# Altium project _nRF9160_tracker.PrjPcb
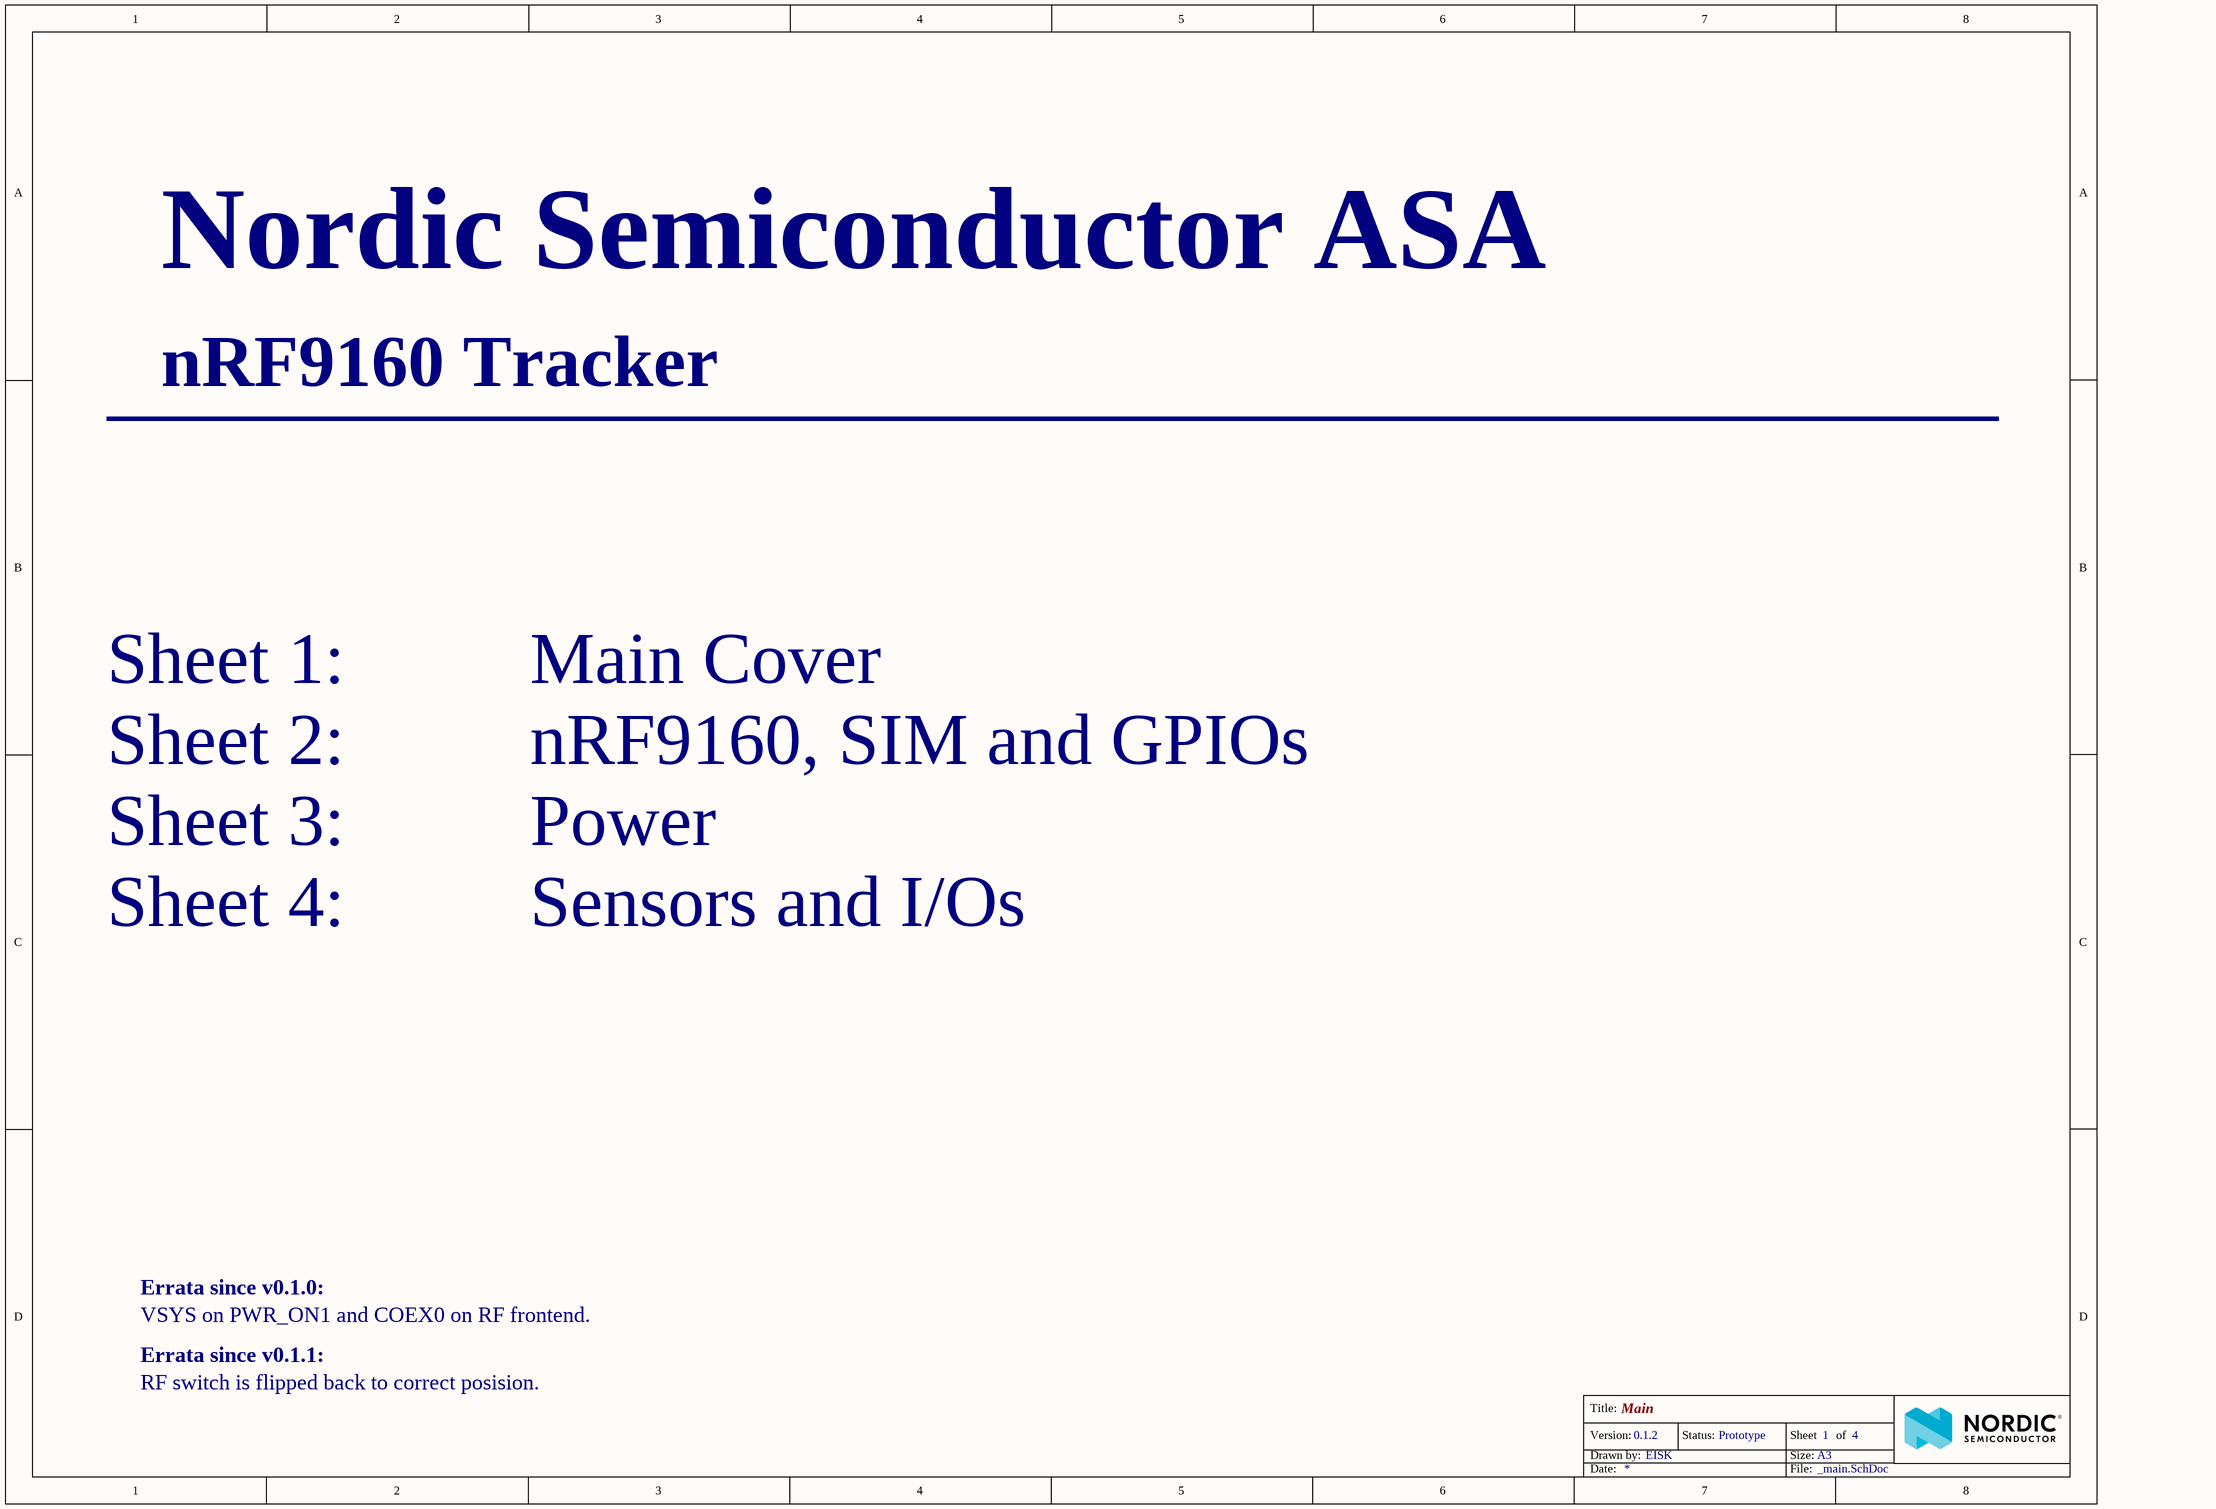
[diagram p0: _main.SchDoc]
4 sheets, 83 parts. Net scope: flat (ports and power ports of the same name join across sheets).
Board file: _tracker.PcbDoc
Sheets:
  _main.SchDoc
  _power.SchDoc
  _nRF9160.SchDoc
  _sensors_and_IOs.SchDoc

## Sheet _main.SchDoc: Main
size A3; CompanyName: Nordic Semiconductor; DrawnBy: EISK; Organization: Nordic Semiconductor; Revision: 1; SheetNumber: 1; SheetTotal: 4; Version: 0.1.2; DesignStatus: Prototype; BoardTitle: nRF9160 Tracker; Time: 2

### Notes on the sheet
- Nordic Semiconductor ASA
- ___________________________________________
- Sheet 1:          Main Cover
- Sheet 2:          nRF9160, SIM and GPIOs
- Sheet 3:          Power
- Sheet 4:          Sensors and I/Os
- Errata since v0.1.0:
- Errata since v0.1.1:
- VSYS on PWR_ON1 and COEX0 on RF frontend.
- RF switch is flipped back to correct posision.
- Title:
- Version:
- Drawn by:
- Status:
- Size:
- Sheet
- A3
- of
- Date:
- File:

## Sheet _power.SchDoc: Power
size A3; DrawnBy: EISK; SheetNumber: 3; SheetTotal: 4; Version: 0.1.2; DesignStatus: Prototype
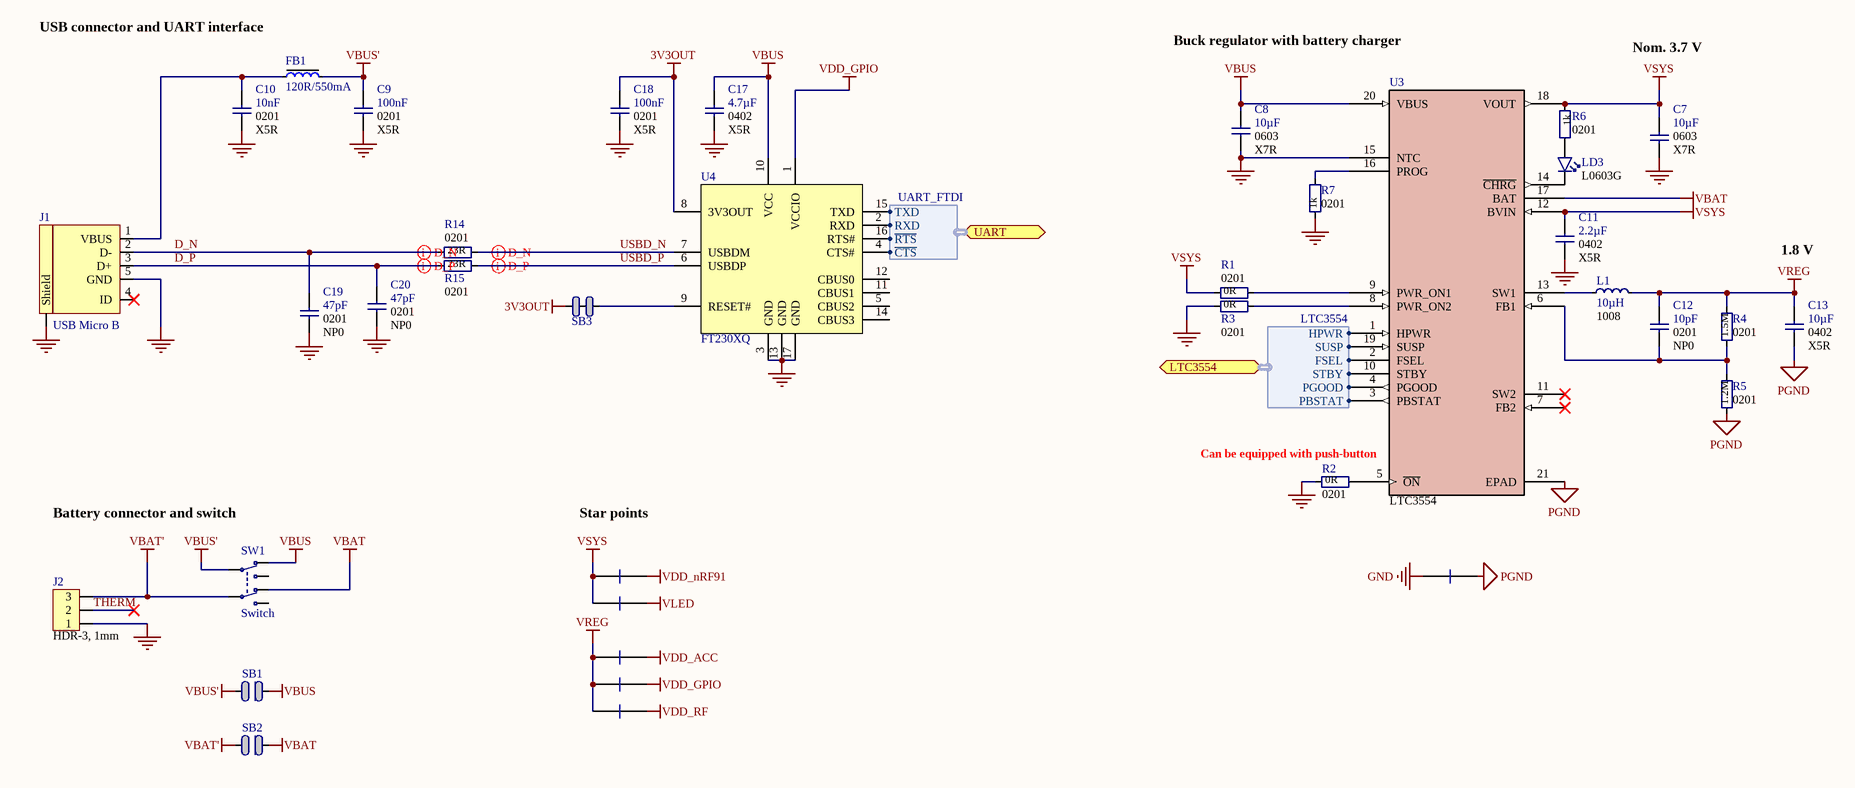
[diagram p1: _power.SchDoc]

### Parts
C7  10µF  Footprint Doc: 0603  TempCoeff: X7R  [CAPC1608X06L]
C8  10µF  Footprint Doc: 0603  TempCoeff: X7R  [CAPC1608X06L]
C9  100nF  Footprint Doc: 0201  TempCoeff: X5R  [CAPC0603X03L_C]
C10  10nF  Footprint Doc: 0201  TempCoeff: X5R  [CAPC0603X03L_C]
C11  2.2µF  Footprint Doc: 0402  TempCoeff: X5R  [CAPC1005X04L]
C12  10pF  Footprint Doc: 0201  TempCoeff: NP0  [CAPC0603X03L_C]
C13  10µF  Footprint Doc: 0402  TempCoeff: X5R  [CAPC1005X04L]
C17  4.7µF  Footprint Doc: 0402  TempCoeff: X5R  [CAPC1005X04L]
C18  100nF  Footprint Doc: 0201  TempCoeff: X5R  [CAPC0603X03L_C]
C19  47pF  Footprint Doc: 0201  TempCoeff: NP0  [CAPC0603X03L_C]
C20  47pF  Footprint Doc: 0201  TempCoeff: NP0  [CAPC0603X03L_C]
FB1  120R/550mA  [INDC1005X04L]
J1  USB Micro B  [USB-Micro-B-RA-SMD-PiP]
J2  HDR-3, 1mm  [SM03B-SRSS-TB]
L1  10µH  Footprint Doc: 1008  [IND1008]
LD3  L0603G  [LED_0603_G]
NT1  Star point  [Net_tie_GND]  (value not drawn)  (net tie, no BOM)
NT2  Star point  [Net_tie_trace]  (value not drawn)  (net tie, no BOM)
NT3  Star point  [Net_tie_trace]  (value not drawn)  (net tie, no BOM)
NT4  Star point  [Net_tie_trace]  (value not drawn)  (net tie, no BOM)
NT5  Star point  [Net_tie_trace]  (value not drawn)  (net tie, no BOM)
NT6  Star point  [Net_tie_trace]  (value not drawn)  (net tie, no BOM)
R1  0R  Footprint Doc: 0201  [RESC0603X03L_C]
R2  0R  Footprint Doc: 0201  [RESC0603X03L_C]
R3  0R  Footprint Doc: 0201  [RESC0603X03L_C]
R4  1.5M  Footprint Doc: 0201  [RESC0603X03L_C]
R5  1.2M  Footprint Doc: 0201  [RESC0603X03L_C]
R6  1k  Footprint Doc: 0201  [RESC0603X03L_C]
R7  1k  Footprint Doc: 0201  [RESC0603X03L_C]
R14  23R  Footprint Doc: 0201  [RESC0603X03L_C]
R15  23R  Footprint Doc: 0201  [RESC0603X03L_C]
SB1  Solderbridge  [Solderbridge]  (value not drawn)  (no BOM)
SB2  Solderbridge  [Solderbridge]  (value not drawn)  (no BOM)
SB3  Solderbridge  [Solderbridge_Shorted]  (value not drawn)  (net tie, no BOM)
SW1  Switch  [Switch-Slide-RA-J-Lead-DPDT-8.5x3.5mm]
U3  LTC3554  [QFN40P300X300X80_HS-21N]
U4  FT230XQ  [QFN65P400X400X80_HS-17N]

### Blocks framed on the sheet
Battery connector and switch: J2 SB1 SB2 SW1

### Ports
LTC3554 (bidir, harness LTC3554), UART (bidir, harness UART_FTDI)

### Harnesses
UART_FTDI: TXD, RXD, ~{RTS}, ~{CTS}
LTC3554: HPWR, SUSP, FSEL, STBY, PGOOD, PBSTAT

### Nets
3V3OUT: C18.1 SB3.2 U4.8(3V3OUT)
GND: C7.2 C8.2 C9.2 C10.2 C11.2 C17.2 C18.2 C19.1 C20.2 J1.5(GND) J1.6(Shield) J2.1 NT1.1 R2.1 R3.1 R7.1 U3.15(NTC) U4.3(GND) U4.13(GND) U4.17(GND)
PGND: C13.2 NT1.2 R5.1 U3.21(EPAD)
VBAT: SB2.2 SW1.6(N.C-2) U3.17(BAT)
VBAT': J2.3 SB2.1 SW1.5(COM-2)
VBUS: C8.1 C17.1 SB1.2 SW1.3(N.C-1) U3.20(VBUS) U4.10(VCC)
VBUS': C9.1 FB1.2 SB1.1 SW1.2(COM-1)
VDD_ACC: NT4.2
VDD_GPIO: NT5.2 U4.1(VCCIO)
VDD_nRF91: NT2.2
VDD_RF: NT6.2
VLED: NT3.2
VREG: C12.1 C13.1 L1.2 NT4.1 NT5.1 NT6.1 R4.2
VSYS: C7.1 C11.1 NT2.1 NT3.1 R1.1 R6.1 U3.12(BVIN) U3.18(VOUT)
D_N: C19.2 J1.2(D-) R14.1
D_P: C20.1 J1.3(D+) R15.1
P0.01: U4.15(TXD) ; port UART.TXD
P0.02: U4.2(RXD) ; port UART.RXD
P0.03: U4.16(RTS#) ; port UART.~{RTS}
P0.04: U4.4(CTS#) ; port UART.~{CTS}
P0.26: U3.10(STBY) ; port LTC3554.STBY
P0.27: U3.19(SUSP) ; port LTC3554.SUSP
P0.28: U3.1(HPWR) ; port LTC3554.HPWR
P0.29: U3.2(FSEL) ; port LTC3554.FSEL
P0.30: U3.3(PBSTAT) ; port LTC3554.PBSTAT
P0.31: U3.4(PGOOD) ; port LTC3554.PGOOD
THERM: J2.2
USBD_N: R14.2 U4.7(USBDM)
USBD_P: R15.2 U4.6(USBDP)
NetC10_1: C10.1 FB1.1 J1.1(VBUS)
NetC12_2: C12.2 R4.1 R5.2 U3.6(FB1)
NetL1_1: L1.1 U3.13(SW1)
NetLD3_1: LD3.1(C) U3.14(~{CHRG})
NetLD3_2: LD3.2(A) R6.2
NetR1_2: R1.2 U3.9(PWR_ON1)
NetR2_2: R2.2 U3.5(~{ON})
NetR3_2: R3.2 U3.8(PWR_ON2)
NetR7_2: R7.2 U3.16(PROG)
NetSB3_1: SB3.1 U4.9(RESET#)

Not connected (* = marked no-connect by the designer): J1 4(ID)*; SW1 1(N.O-1) 4(N.O-2); U3 7(FB2)* 11(SW2)*; U4 5(CBUS2) 11(CBUS1) 12(CBUS0) 14(CBUS3)

### Layout directives
differential pair; differential pair class D1: D_N, D_P, USBD_N, USBD_P

### Notes on the sheet
- (near FB1) USB connector and UART interface
- Buck regulator with battery charger
- Nom. 3.7 V
- (near U3) 500 mA charge current from USB host.
- 1.8 V
- Star points
- (near U3) Can be equipped with push-button
- Title:
- Version:
- Drawn by:
- Status:
- Size:
- Sheet
- A3
- of
- Date:
- File:

### Library data of the parts
C7 C8 = CAP:0603: Capacitor, X7R, ±10%; Note: s; Artikkelnr Noca: N.A.; Manufacturer: *; Manufacturer Part Number: *; LatestRevisionDate: 2014-11-13; Pin Count: 2; Publisher: Nordic Semiconductor; Published: 2014-11-13; Value: 10µF; HelpURL: *; Supplier 1: *; Supplier Part Number 1: *; Supplier 2: *; Supplier Part Number 2: *
C9 C10 C18 = CAP:0201: Capacitor, X5R, ±10%, 10V; Artikkelnr Noca: N.A.; Manufacturer: *; Manufacturer Part Number: *; LatestRevisionDate: 2014-11-13; Pin Count: 2; Publisher: Nordic Semiconductor; Published: 2014-11-13; HelpURL: *; Supplier 1: *; Supplier Part Number 1: *; Supplier 2: *; Supplier Part Number 2: *
  C9: Value: 100nF; Note: 10V
  C10: Value: 10nF; Note: 10V
  C18: Value: 100nF; Note: *
C11 C17 = CAP:0402: Capacitor, X5R, ±10%, 16V; Artikkelnr Noca: N.A.; Manufacturer: *; Manufacturer Part Number: *; LatestRevisionDate: 2014-11-13; Pin Count: 2; Publisher: Nordic Semiconductor; Published: 2014-11-13; Note: 16V; HelpURL: *; Supplier 1: *; Supplier Part Number 1: *; Supplier 2: *; Supplier Part Number 2: *
  C11: Value: 2.2µF
  C17: Value: 4.7µF
C12 = CAP:0201: Capacitor, NP0; Artikkelnr Noca: N.A.; Manufacturer: *; Manufacturer Part Number: *; LatestRevisionDate: 2014-11-13; Pin Count: 2; Publisher: Nordic Semiconductor; Published: 2014-11-13; Value: 10pF; Note: *; HelpURL: *; Supplier 1: *; Supplier Part Number 1: *; Supplier 2: *; Supplier Part Number 2: *
C13 = CAP:0402: Capacitor, X5R, ±20%; Note: 16V; Artikkelnr Noca: N.A.; Manufacturer: *; Manufacturer Part Number: *; LatestRevisionDate: 2014-11-13; Pin Count: 2; Publisher: Nordic Semiconductor; Published: 2014-11-13; Value: 10µF; HelpURL: *; Supplier 1: *; Supplier Part Number 1: *; Supplier 2: *; Supplier Part Number 2: *
C19 C20 = CAP:0201: Capacitor, NP0; Note: 10V; Artikkelnr Noca: N.A.; Manufacturer: *; Manufacturer Part Number: *; LatestRevisionDate: 2014-11-13; Pin Count: 2; Publisher: Nordic Semiconductor; Published: 2014-11-13; Value: 47pF; HelpURL: *; Supplier 1: *; Supplier Part Number 1: *; Supplier 2: *; Supplier Part Number 2: *
FB1 = FB0402-120R@100M-500mA: Ferrite Bead, 120 Ohm @ 100MHz, 500mA, 250 mOhm Max; Part Number: FB0805-120R@100M-550mA; Manufacturer: Murata; Manufacturer Part Number: BLM15AG121SN1D; Part number IPS: N.A.; Note: Chip EMIFIL Inductor Type Chip Ferrite Bead; Artikkelnr Noca: 33029317; Footprint Doc: 0402; LatestRevisionDate: 2019-06-06; Pin Count: 2; Publisher: Nordic Semiconductor; Published: 2011-11-14; Value: 120R/550mA; ComponentLink1Description: Datasheet; ComponentLink2URL: https://www.murata.com/en-global/products/productdata/8796733767710/S0580E.pdf; ComponentLink2Description: Datasheet; Datasheet: http://search.murata.co.jp/Ceramy/image/img/PDF/ENG/L0110S0100BLM15A_SN.pdf; Artikkelnr Simpro: N.A.; Supplier 1: Digi-Key; Supplier Part Number 1: 490-1005-1-ND
J1 = MiniUSB-AB-SMT: MicroUSB-B-SMT; Manufacturer: Amphenol ICC (FCI); Manufacturer Part Number: 10118194-0001LF; Part number IPS: 00000007790; Artikkelnr Noca: 55029020; Artikkelnr Simpro: N.A.; Part Number: USB-Micro-B-RA-SMD-PiP; Footprint Doc: USB-Micro-B-RA-SMD-PiP; LatestRevisionDate: 2016-04-21; Pin Count: 5; Publisher: Nordic Semiconductor; Published: 2014-10-07; Value: USB Micro B; Note: *; Supplier 1: Mouser; Supplier 2: Digi-Key; Supplier Part Number 1: 649-10118193-0001LF; Supplier Part Number 2: 609-4616-1-ND
J2 = CONN-3: 1.0mm pitch connector side entry SMD; Manufacturer: JST; Manufacturer Part Number: SM03B-SRSS-TB(LF)(SN); Part number IPS: 00000001785; Note: JST, Header; Artikkelnr Noca: N.A.; Part Number: SM03B-SRSS-TB; Footprint Doc: SM03B-SRSS-TB; LatestRevisionDate: 2017-10-09; Pin Count: 3; Publisher: Nordic Semiconductor; Published: 2017-10-09; Value: HDR-3, 1mm; HelpURL: http://www.jst-mfg.com/product/pdf/eng/eSH.pdf; Supplier 1: Digi-Key; Supplier Part Number 1: 455-1803-1-ND
L1 = IND:1008_REG: Switching regulator chip inductor, 2-Leads, Body 2.5x2.0x1.1 mm; Manufacturer: Wurth Electronics Inc.; Manufacturer Part Number: 74479787247; Datasheet: Not available; LatestRevisionDate: 2019-06-13; Pin Count: 2; Publisher: Nordic Semiconductor; Published: 2019-07-02; Value: 10µH; ComponentLink2Description: Supplier link; Supplier 1: Digi-Key; Supplier 2: Mouser; Supplier Part Number 1: 732-14079-1-ND; Supplier Part Number 2: 710-74479787247; ComponentLink1Description: Digi-Key
LD3 = D:LED: LED, Green, 0603, 570nm, Vf=1.7V, 2.24..5.6mcd, - 40 to +100°C; Part Number: LG L29K Smartled Green; Manufacturer: Osram; Manufacturer Part Number: LG L29K-G2J1-24-Z; Part number IPS: N.A.; Note: 2.24..5.6 mcd, Vfmin=1.7V; Artikkelnr Noca: 13019147; Footprint Doc: 0603; LatestRevisionDate: 2017-08-21; Pin Count: 2; Publisher: Nordic Semiconductor; Published: 2014-10-28; Value: L0603G; ComponentLink1URL: *; ComponentLink1Description: Datasheet; ComponentLink2URL: *; ComponentLink2Description: Supplier link; HelpURL: http://www.osram-os.com/Graphics/XPic2/00077107_0.pdf; Supplier 1: Digi-Key; Supplier Part Number 1: 475-2709-1-ND; Supplier 2: Mouser; Supplier Part Number 2: 720-LGL29KG2J124Z
NT1-NT6 = NT:Trace
R1-R7 R14 R15 = RES:0201: Manufacturer: *; Manufacturer Part Number: *; Package: 0201; Publisher: Nordic Semiconductor; LatestRevisionDate: 2019-06-11
  R1-R3: Value: 0R
  R4: Value: 1.5M
  R5: Value: 1.2M
  R6 R7: Value: 1k
  R14 R15: Value: 23R
SB1 SB2 = SOLDERBRIDGE: Note: Not in BOM; ComponentLink1URL: *; ComponentLink1Description: Datasheet; ComponentLink2URL: *; ComponentLink2Description: Supplier link; Footprint Doc: Solderbridge; Pin Count: 2; Publisher: Nordic Semiconductor; Published: 2019-07-17; Value: Solderbridge
SB3 = SOLDERBRIDGE_SHORTED: Shorted Solderbridge; Note: Not in BOM; Footprint Doc: Solderbridge Shorted; Pin Count: 2; Publisher: Nordic Semiconductor; Published: 2012-08-07; Value: Solderbridge
SW1 = SW-DPDT: SMD slide Switch (ON-ON); Part Number: Switch-Slide-RA-J-Lead-DPDT-8.5x3.5mm_Copal; Manufacturer: Copal Electronics Inc; Manufacturer Part Number: CL-SB-22A-11T; Part number IPS: 00000007811; Artikkelnr Noca: N.A.; Footprint Doc: Switch-Slide-RA-J-Lead-DPDT-8.5x3.5mm; LatestRevisionDate: 2017-02-01; Pin Count: 6; Publisher: Nordic Semiconductor; Published: 2017-02-01; Value: Switch; Note: *; HelpURL: http://www.nidec-copal-electronics.com/e/catalog/switch/cl-sb.pdf; Supplier 1: Digi-Key; Supplier Part Number 1: 563-1340-1-ND; Supplier 2: Avnet; Supplier Part Number 2: CL-SB-22A-11T
U3 = LTC3554EUD-3#PBF: IC USB POWER MANAGER 20UTQFN; Vendor: Linear Technology; Built_By: Eirik Hovde Skanke; Manufacturer_Part_Number: LTC3554EUD-3#PBF; Copyright: Nordic Semiconductor; Value: LTC3554; ComponentLink1Description: Datasheet; ComponentLink1URL: https://www.analog.com/media/en/technical-documentation/data-sheets/355412ff.pdf; ComponentLink2Description: Digi-Key; ComponentLink2URL: https://www.digikey.com/product-detail/en/linear-technology-analog-devices/LTC3554EUD-PBF/LTC3554EUD-PBF-ND/2355199
U4 = FT230X: USB Bridge, USB to UART USB 2.0 UART Interface 16-QFN (4x4); Manufacturer: FTDI; Artikkelnr Noca: N.A.; Part Number: FT230XQ; Manufacturer Part Number: FT230XQ; Footprint Doc: QFN-16; LatestRevisionDate: 2019-07-04; Pin Count: 16; Publisher: Nordic Semiconductor; Published: 2019-07-04; Value: FT230XQ; Note: *; Supplier 1: Digi-Key; Supplier Part Number 1: 768-1130-1-ND; ComponentLink1Description: Datasheet; ComponentLink1URL: https://www.ftdichip.com/Support/Documents/DataSheets/ICs/DS_FT230X.pdf

## Sheet _nRF9160.SchDoc: nRF9160, SIM and GPIOs
size A3; CompanyName: Nordic Semiconductor ASA; DrawnBy: EISK; SheetNumber: 2; SheetTotal: 4; DesignStatus: Prototype; Version: 0.1.2
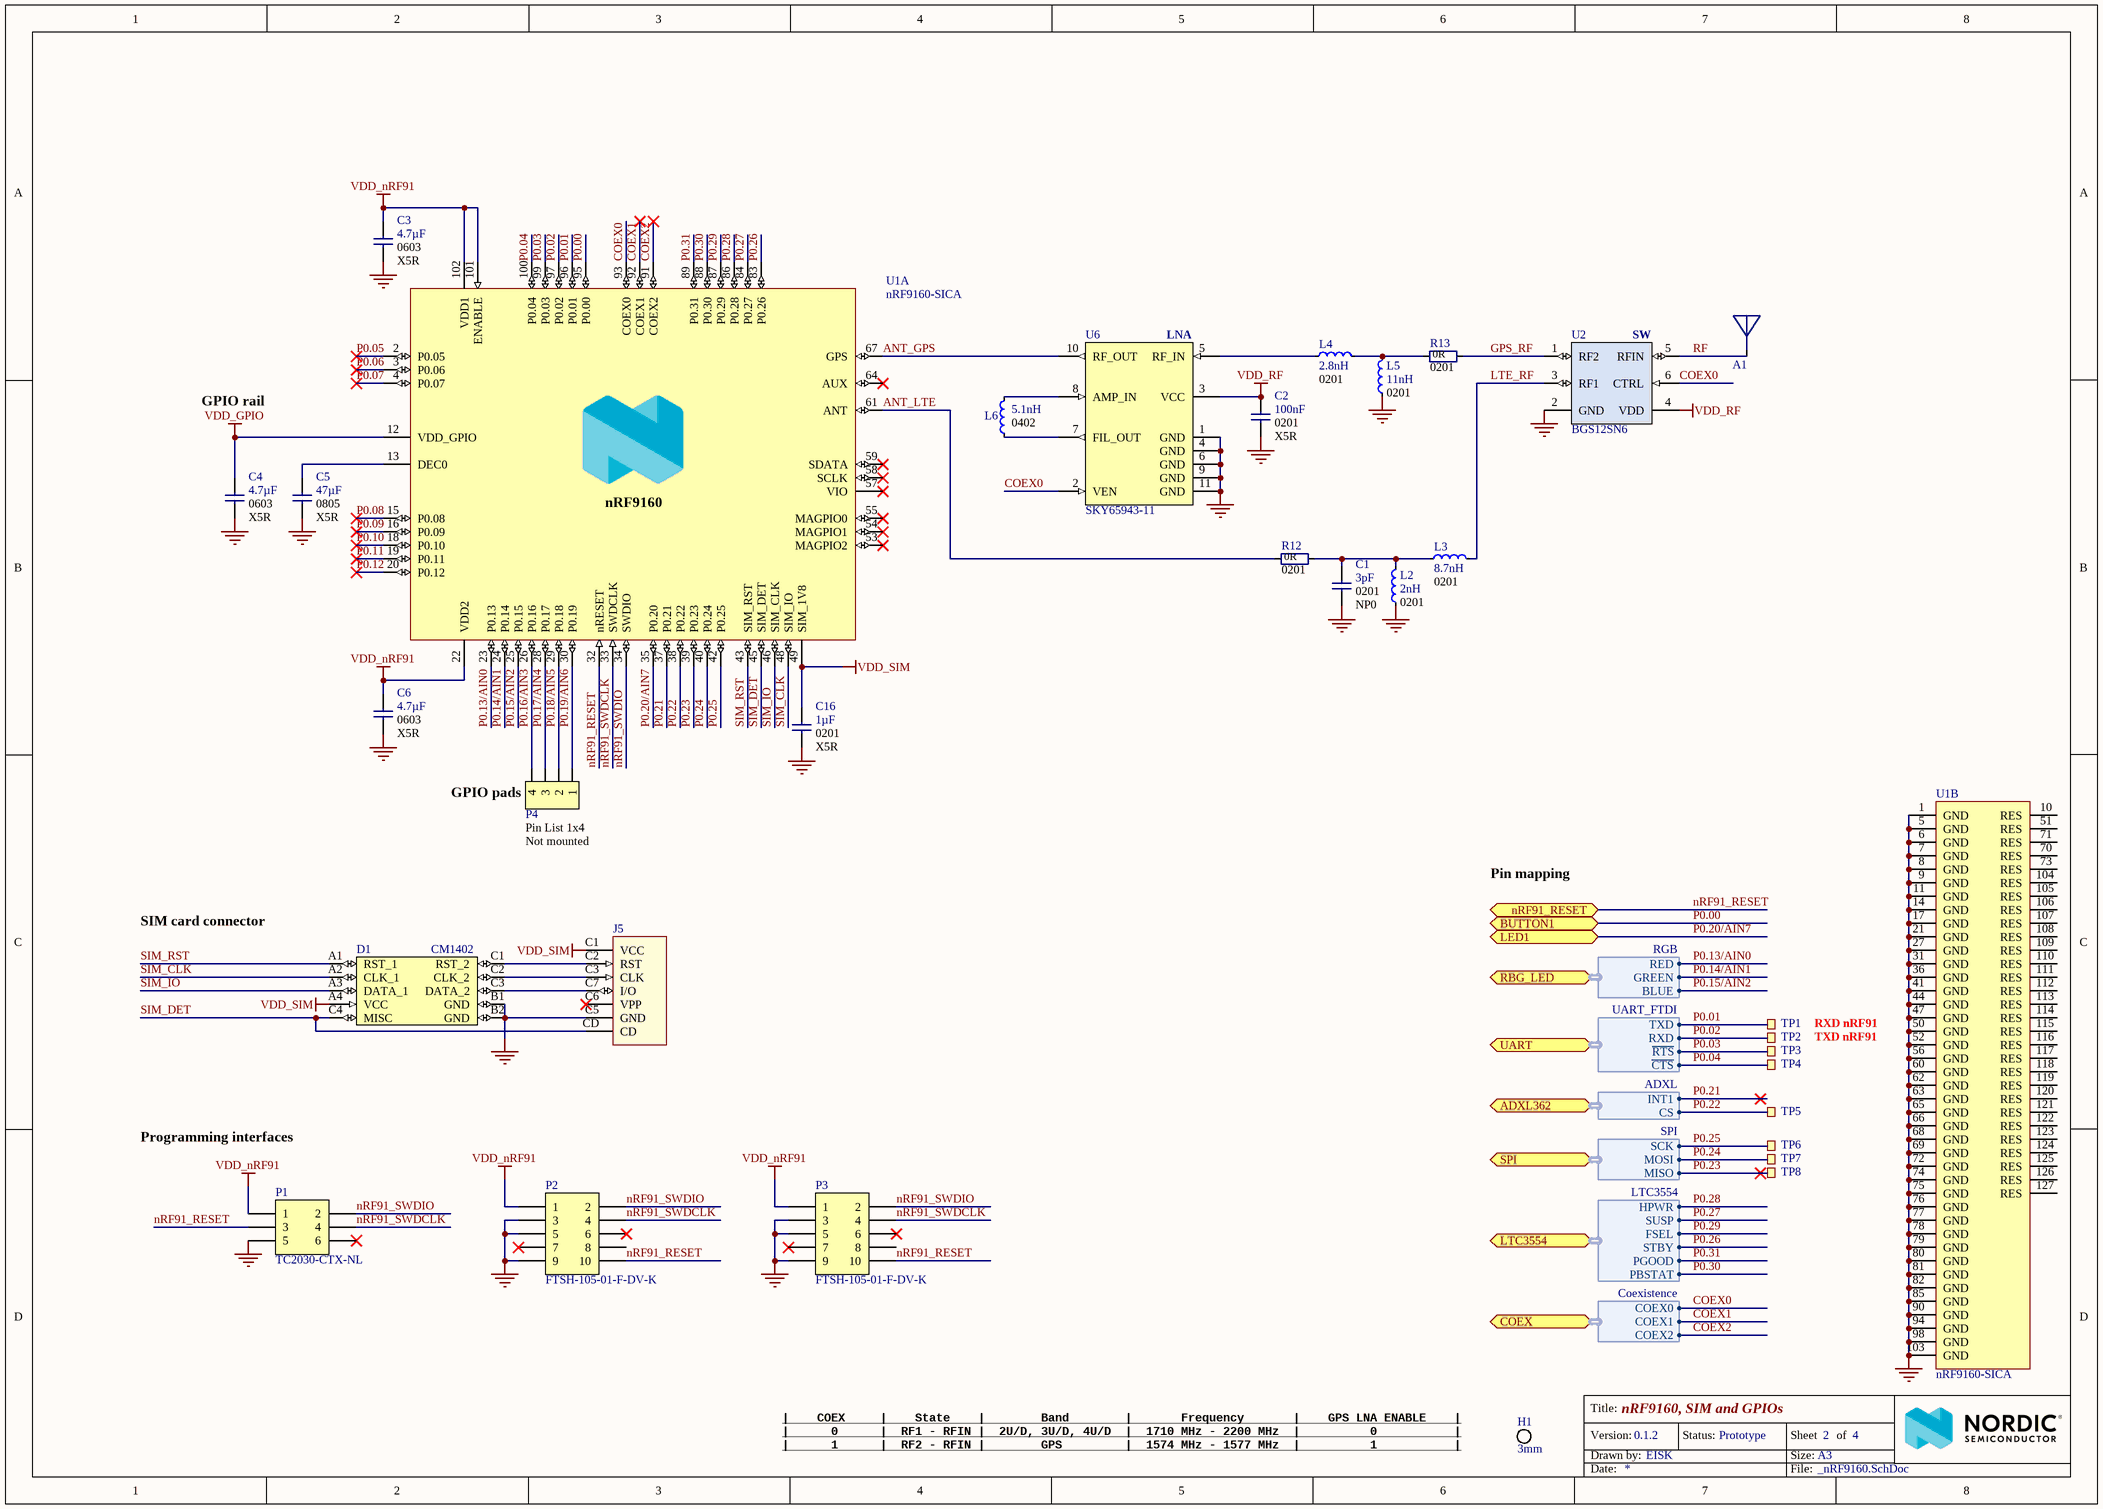
[diagram p2: _nRF9160.SchDoc]

### Parts
A1  FR01-S4-250  [FRACTUS_CUBE_mXTEND]  (value not drawn)
C1  3pF  Footprint Doc: 0201  TempCoeff: NP0  [CAPC0603X03L_C]
C2  100nF  Footprint Doc: 0201  TempCoeff: X5R  [CAPC0603X03L_C]
C3  4.7µF  Footprint Doc: 0603  TempCoeff: X5R  [CAPC1608X06L]
C4  4.7µF  Footprint Doc: 0603  TempCoeff: X5R  [CAPC1608X06L]
C5  47µF  Footprint Doc: 0805  TempCoeff: X5R  [CAPC2012X11L]
C6  4.7µF  Footprint Doc: 0603  TempCoeff: X5R  [CAPC1608X06L]
C16  1µF  Footprint Doc: 0201  TempCoeff: X5R  [CAPC0603X03L_C]
D1  CM1402  [CM1402]
H1  3mm  [HOLE_NP_3MM]  (no BOM)
J5  SIM8055-6-1-14-00-A_revA1  [GCT_SIM8055-6-1-14-00-A_revA1]  (value not drawn)
L2  2nH  Footprint Doc: 0201  [INDC0603X03L_C]
L3  8.7nH  Footprint Doc: 0201  [INDC0603X03L_C]
L4  2.8nH  Footprint Doc: 0201  [INDC0603X03L_C]
L5  11nH  Footprint Doc: 0201  [INDC0603X03L_C]
L6  5.1nH  Footprint Doc: 0402  [INDC1005X04L_WW]
P1  TC2030-CTX-NL  [TC2030-IDC-NLFP]  (no BOM)
P2  FTSH-105-01-F-DV-K  [HDR_2x5-SMD-1.27mm]  (no BOM)
P3  FTSH-105-01-F-DV-K  [HDR_2x5-SMD-1.27mm-K]  (no BOM)
P4  Pin List 1x4  Assembly: Not mounted  [LIST_1x4-NC]  (no BOM)
R12  0R  Footprint Doc: 0201  [RESC0603X03L_C]
R13  0R  Footprint Doc: 0201  [RESC0603X03L_C]
TP1  Ø1.0mm,SMD  [TP_SMD_Ø1.0mm]  (value not drawn)  (no BOM)
TP2  Ø1.0mm,SMD  [TP_SMD_Ø1.0mm]  (value not drawn)  (no BOM)
TP3  Ø1.0mm,SMD  [TP_SMD_Ø1.0mm]  (value not drawn)  (no BOM)
TP4  Ø1.0mm,SMD  [TP_SMD_Ø1.0mm]  (value not drawn)  (no BOM)
TP5  Ø1.0mm,SMD  [TP_SMD_Ø1.0mm]  (value not drawn)  (no BOM)
TP6  Ø1.0mm,SMD  [TP_SMD_Ø1.0mm]  (value not drawn)  (no BOM)
TP7  Ø1.0mm,SMD  [TP_SMD_Ø1.0mm]  (value not drawn)  (no BOM)
TP8  Ø1.0mm,SMD  [TP_SMD_Ø1.0mm]  (value not drawn)  (no BOM)
U1  nRF9160-SICA  [LGA50P1600X1050X104-161N]  (parts A,B of 2)
U2  BGS12SN6  [PG-TSNP-6-2]
U6  SKY65943-11  [SKY6594311]

### Ports
ADXL362 (bidir, harness ADXL), BUTTON1 (bidir), COEX (bidir, harness Coexistence), LED1 (bidir), LTC3554 (bidir, harness LTC3554), nRF91_RESET (bidir), RBG_LED (bidir, harness RGB), SPI (bidir, harness SPI), UART (bidir, harness UART_FTDI)

### Harnesses
SPI: MISO, MOSI, SCK
ADXL: CS, INT1
UART_FTDI: RXD, TXD, ~{CTS}, ~{RTS}
LTC3554: HPWR, SUSP, FSEL, STBY, PGOOD, PBSTAT
RGB: RED, GREEN, BLUE
Coexistence: COEX2, COEX1, COEX0

### Nets
GND: C1.2 C2.2 C3.2 C4.2 C5.2 C6.2 C16.2 D1.B1(GND) D1.B2(GND) J5.C5(GND) L2.1 L5.1 P1.5 P2.3 P2.5 P2.9 P3.3 P3.5 P3.9 U1.1(GND) U1.5(GND) U1.6(GND) U1.7(GND) U1.8(GND) U1.9(GND) U1.11(GND) U1.14(GND) U1.17(GND) U1.21(GND) U1.27(GND) U1.31(GND) U1.36(GND) U1.41(GND) U1.44(GND) U1.47(GND) U1.50(GND) U1.52(GND) U1.56(GND) U1.60(GND) U1.62(GND) U1.63(GND) U1.65(GND) U1.66(GND) U1.68(GND) U1.69(GND) U1.72(GND) U1.74(GND) U1.75(GND) U1.76(GND) U1.77(GND) U1.78(GND) U1.79(GND) U1.80(GND) U1.81(GND) U1.82(GND) U1.85(GND) U1.90(GND) U1.94(GND) U1.98(GND) U1.103(GND) U2.2(GND) U6.1(GND) U6.4(GND) U6.6(GND) U6.9(GND) U6.11(GND)
VDD_GPIO: C4.1 U1.12(VDD_GPIO)
VDD_nRF91: C3.1 C6.1 P1.1 P2.1 P3.1 U1.22(VDD2) U1.101(ENABLE) U1.102(VDD1)
VDD_RF: C2.1 U2.4(VDD) U6.3(VCC)
VDD_SIM: C16.1 D1.A4(VCC) J5.C1(VCC) U1.49(SIM_1V8)
ANT_GPS: U1.67(GPS) U6.10(RF_OUT)
ANT_LTE: R12.1 U1.61(ANT)
COEX0: U1.93(COEX0) U2.6(CTRL) U6.2(VEN) ; port COEX.COEX0
COEX1: U1.92(COEX1) ; port COEX.COEX1
COEX2: U1.91(COEX2) ; port COEX.COEX2
GPS_RF: R13.2 U2.1(RF2)
LTE_RF: L3.2 U2.3(RF1)
nRF91_RESET: P1.3 P2.10 P3.10 U1.32(nRESET) ; port nRF91_RESET
nRF91_SWDCLK: P1.4 P2.4 P3.4 U1.33(SWDCLK)
nRF91_SWDIO: P1.2 P2.2 P3.2 U1.34(SWDIO)
P0.00: U1.95(P0.00) ; port BUTTON1
P0.01: TP1.1 U1.96(P0.01) ; port UART.TXD
P0.02: TP2.1 U1.97(P0.02) ; port UART.RXD
P0.03: TP3.1 U1.99(P0.03) ; port UART.~{RTS}
P0.04: TP4.1 U1.100(P0.04) ; port UART.~{CTS}
P0.05: U1.2(P0.05)
P0.06: U1.3(P0.06)
P0.07: U1.4(P0.07)
P0.08: U1.15(P0.08)
P0.09: U1.16(P0.09)
P0.10: U1.18(P0.10)
P0.11: U1.19(P0.11)
P0.12: U1.20(P0.12)
P0.13/AIN0: U1.23(P0.13) ; port RBG_LED.RED
P0.14/AIN1: U1.24(P0.14) ; port RBG_LED.GREEN
P0.15/AIN2: U1.25(P0.15) ; port RBG_LED.BLUE
P0.16/AIN3: P4.4 U1.26(P0.16)
P0.17/AIN4: P4.3 U1.28(P0.17)
P0.18/AIN5: P4.2 U1.29(P0.18)
P0.19/AIN6: P4.1 U1.30(P0.19)
P0.20/AIN7: U1.35(P0.20) ; port LED1
P0.21: U1.37(P0.21) ; port ADXL362.INT1
P0.22: TP5.1 U1.38(P0.22) ; port ADXL362.CS
P0.23: TP8.1 U1.39(P0.23) ; port SPI.MISO
P0.24: TP7.1 U1.40(P0.24) ; port SPI.MOSI
P0.25: TP6.1 U1.42(P0.25) ; port SPI.SCK
P0.26: U1.83(P0.26) ; port LTC3554.STBY
P0.27: U1.84(P0.27) ; port LTC3554.SUSP
P0.28: U1.86(P0.28) ; port LTC3554.HPWR
P0.29: U1.87(P0.29) ; port LTC3554.FSEL
P0.30: U1.88(P0.30) ; port LTC3554.PBSTAT
P0.31: U1.89(P0.31) ; port LTC3554.PGOOD
RF: A1.1 U2.5(RFIN)
SIM_CLK: D1.A2(CLK_1) U1.48(SIM_IO)
SIM_DET: D1.C4(MISC) J5.CD U1.45(SIM_DET)
SIM_IO: D1.A3(DATA_1) U1.46(SIM_CLK)
SIM_RST: D1.A1(RST_1) U1.43(SIM_RST)
NetC1_1: C1.1 L2.2 L3.1 R12.2
NetC5_1: C5.1 U1.13(DEC0)
NetD1_C1: D1.C1(RST_2) J5.C2(RST)
NetD1_C2: D1.C2(CLK_2) J5.C3(CLK)
NetD1_C3: D1.C3(DATA_2) J5.C7(I/O)
NetL4_1: L4.1 U6.5(RF_IN)
NetL4_2: L4.2 L5.2 R13.1
NetL6_1: L6.1 U6.7(FIL_OUT)
NetL6_2: L6.2 U6.8(AMP_IN)

Not connected (* = marked no-connect by the designer): J5 C6(VPP)*; P1 6*; P2 6* 7* 8; P3 6* 7* 8; U1 10(RES) 51(RES) 53(MAGPIO2)* 54(MAGPIO1)* 55(MAGPIO0)* 57(VIO)* 58(SCLK)* 59(SDATA)* 64(AUX)* 70(RES) 71(RES) 73(RES) 104(RES) 105(RES) 106(RES) 107(RES) 108(RES) 109(RES) 110(RES) 111(RES) 112(RES) 113(RES) 114(RES) 115(RES) 116(RES) 117(RES) 118(RES) 119(RES) 120(RES) 121(RES) 122(RES) 123(RES) 124(RES) 125(RES) 126(RES) 127(RES)

### Notes on the sheet
- (near U6) LNA
- (near U2) SW
- GPIO rail
- (near P4) GPIO pads
- Pin mapping
- SIM card connector
- RXD nRF91
- TXD nRF91
- Programming interfaces
- (near H1) |    COEX     |    State    |        Band        |       Frequency       |    GPS LNA ENABLE    |
  |      0      |  RF1 - RFIN |  2U/D, 3U/D, 4U/D  |  1710 MHz - 2200 MHz  |          0           |
  |      1      |  RF2 - RFIN |        GPS         |  1574 MHz - 1577 MHz  |          1           |
- Title:
- Version:
- Drawn by:
- Status:
- Size:
- Sheet
- A3
- of
- Date:
- File:
- (in symbol nRF9160_SICA, part A) nRF9160

### Library data of the parts
A1 = ANT:CUBE_mXTEND: CUBE mXTEND Antenna Booster (GSM, UMTS, LTE); Manufacturer: Fractus Antennas S.L.; Supplier 1: Digi-Key; Supplier Part Number 1: 2115-FR01-S4-250CT-ND; Manufacturer Part Number: FR01-S4-250; ComponentLink1Description: Datasheet; ComponentLink1URL: https://www.fractusantennas.com/wp-content/uploads/2018/01/UM_FR01-S4-250.pdf; Value: FR01-S4-250; ComponentLink2Description: Digi-Key; ComponentLink2URL: https://www.digikey.no/product-detail/en/fractus-antennas-s-l/FR01-S4-250/2115-FR01-S4-250CT-ND/10108319
C1 = CAP:0201: Capacitor, NP0, ±10%, 10V; Artikkelnr Noca: N.A.; Manufacturer: *; Manufacturer Part Number: *; LatestRevisionDate: 2014-11-13; Pin Count: 2; Publisher: Nordic Semiconductor; Published: 2014-11-13; Value: 3pF; Note: 10V; HelpURL: *; Supplier 1: *; Supplier Part Number 1: *; Supplier 2: *; Supplier Part Number 2: *
C2 C16 = CAP:0201: as C9 on sheet _power; Manufacturer: *; Manufacturer Part Number: *; LatestRevisionDate: 2014-11-13; Pin Count: 2; Publisher: Nordic Semiconductor; Published: 2014-11-13; HelpURL: *; Supplier 1: *; Supplier Part Number 1: *; Supplier 2: *; Supplier Part Number 2: *
  C2: Value: 100nF; Note: *
  C16: Value: 1µF; Note: 10V
C3 C4 C6 = CAP:0603: Capacitor, X5R, ±10%, 6.3V; Artikkelnr Noca: N.A.; Manufacturer: *; Manufacturer Part Number: *; LatestRevisionDate: 2014-11-13; Pin Count: 2; Publisher: Nordic Semiconductor; Published: 2014-11-13; Value: 4.7µF; Note: 6.3V; HelpURL: *; Supplier 1: *; Supplier Part Number 1: *; Supplier 2: *; Supplier Part Number 2: *
C5 = CAP:0805: Capacitor, X5R, ±20%, 6.3V; Note: s; Artikkelnr Noca: N.A.; Manufacturer: *; Manufacturer Part Number: *; LatestRevisionDate: 2014-11-13; Pin Count: 2; Publisher: Nordic Semiconductor; Published: 2014-11-13; HelpURL: *; Supplier 1: *; Supplier Part Number 1: *; Supplier 2: *; Supplier Part Number 2: *; Value: 47µF
D1 = CM1402: EMI Network Filter Arrays SIM CARD EMI FILTER WITH ESD PROTECTION; Manufacturer: ON Semiconductor; Manufacturer Part Number: CM1402-03CP; Artikkelnr Noca: N.A.; Part Number: CM1402; Footprint Doc: CM1402; LatestRevisionDate: 2017-02-06; Publisher: Nordic Semiconductor; Published: 2017-02-06; Value: CM1402; Note: *; ComponentLink1URL: *; ComponentLink1Description: Datasheet; ComponentLink2URL: *; ComponentLink2Description: Supplier link; Pin Count: 10; Supplier 1: Mouser; Supplier Part Number 1: 748-CM1402-03CP; Supplier 2: Digi-Key; Supplier Part Number 2: CM1402-03CPOSCT-ND; Part number IPS: N.A.; Datasheet: http://www.onsemi.com/pub_link/Collateral/CM1402-D.PDF
H1 = HOLE:M3: Value: 3mm
J5 = SIM8055-6-1-14-00-A_revA1: Nano SIM Card Connector, Push-Pull Type, 6 Pin, SMT, Profile 1.35mm; Manufacturer: GCT; Manufacturer Part Number: SIM8055-6-1-14-00-A; Supplier: Digi-Key; Supplier Part Number: 2073-SIM8055-6-1-14-00-ADKR-ND; ComponentLink1Description: Information Page; ComponentLink1URL: https://gct.co/connector/digi-key/sim8055; ComponentLink2Description: Digi-Key; ComponentLink2URL: https://www.digikey.com/product-detail/en/gct/SIM8055-6-1-14-00-A/2073-SIM8055-6-1-14-00-ADKR-ND/9859771
L2-L5 = IND:0201: Inductor, 350mA, ±3%; Manufacturer: Murata; Manufacturer Part Number: *; HelpURL: *; LatestRevisionDate: 2017-07-19; Pin Count: 2; Publisher: Nordic Semiconductor; Published: 2013-04-10; Note: *; Supplier 1: *; Supplier Part Number 1: *; Supplier 2: *; Supplier Part Number 2: *
  L2: Value: 2nH
  L3: Value: 8.7nH
  L4: Value: 2.8nH
  L5: Value: 11nH
L6 = IND:Murata: Inductor, 600mA, ±0.1nH, 120mΩ, Q=25; Part Number: L0402-5n1-Wirewound-Murata; Manufacturer: Murata; Manufacturer Part Number: LQW15AN5N1B00; Note: -55°C ~ 125°C; Artikkelnr Noca: N.A.; ComponentLink1URL: https://search.murata.co.jp/Ceramy/image/img/P02/JELF243A-0050.pdf; ComponentLink1Description: Datasheet; ComponentLink2URL: *; ComponentLink2Description: Supplier link; HelpURL: https://psearch.en.murata.com/inductor/product/LQW15AN5N1B00%23.html; LatestRevisionDate: 2019-04-16; Pin Count: 2; Publisher: Nordic Semiconductor; Published: 2019-04-16; Value: 5.1nH; Supplier 1: Digi-Key; Supplier Part Number 1: 490-6831-1-ND; Part number IPS: N.A.
P1 = CONN-2x3_No_BOM: CBL PLUG-OF-NAILS 6-PIN; Manufacturer: Tag-Connect LLC; Artikkelnr Noca: N.A.; Part Number: TC2030-CTX-NL; Manufacturer Part Number: TC2030-CTX-NL; Datasheet: http://www.tag-connect.com/Materials/TC2030-IDC-NL.pdf; LatestRevisionDate: 2013-08-08; Pin Count: 6; Publisher: Nordic Semiconductor; Published: 2013-08-08; Value: TC2030-CTX-NL; Supplier: Tag-Connect; Supplier part number: TC2030-CTX-NL; 2nd source Supplier: *; 2nd source part number: *
P2 = Header 2x5 No-BOM: Connector Header Surface Mount 10 position 0.050" (1.27mm); Manufacturer: Samtec Inc.; Manufacturer Part Number: FTSH-105-01-F-DV-K; Value: FTSH-105-01-F-DV-K; Footprint: *; Package: *; Publisher: Nordic Semiconductor; 2nd Manufacturer Part Number: *; 2nd Manufacturer: *; LatestRevisionDate: 2018-10-15; Supplier 1: Digi-Key; Supplier Part Number 1: SAM8796-ND; Supplier 2: Newark; Supplier Part Number 2: 45P5160; Supplier 3: Farnell; Supplier Part Number 3: 2856430; Supplier 4: Mouser; Supplier Part Number 4: 200-FTSH10501FDVK
P3 = Header 2x5 Shielded SMD: Connector Header Surface Mount 10 position 0.050" (1.27mm); Manufacturer: Samtec Inc.; Manufacturer Part Number: FTSH-105-01-F-DV-K; Value: FTSH-105-01-F-DV-K; Footprint: *; Package: *; Publisher: Nordic Semiconductor; 2nd Manufacturer Part Number: *; 2nd Manufacturer: *; LatestRevisionDate: 2018-10-15; Supplier 1: Digi-Key; Supplier Part Number 1: SAM8796-ND; Supplier 2: Newark; Supplier Part Number 2: 45P5160; Supplier 3: Farnell; Supplier Part Number 3: 2856430; Supplier 4: Mouser; Supplier Part Number 4: 200-FTSH10501FDVK
P4 = CONN-4: Pin List 1x4, 2.54mm (100mil); Note: Pin List 1x4, N.C.; Footprint Doc: LIST_1x4; Pin Count: 4; Publisher: Nordic Semiconductor; Published: 2019-07-17; Value: Pin List 1x4
R12 R13 = RES:0201: Manufacturer: *; Manufacturer Part Number: *; Package: 0201; Publisher: Nordic Semiconductor; LatestRevisionDate: 2019-06-11; Value: 0R
TP1-TP8 = TESTPAD: 1.0mm circular SMD testpad; Manufacturer: Nordic Semiconductor; Footprint Doc: TP_SMD_Ø1.0mm; LatestRevisionDate: 2013-06-11; Pin Count: 1; Publisher: Nordic Semiconductor; Published: 2013-06-11; Value: Ø1.0mm,SMD; ComponentLink1URL: *; ComponentLink1Description: Datasheet; ComponentLink2URL: *; ComponentLink2Description: Supplier link
U1 = nRF9160_SICA: Low power System-in-Package with integrated LTE-M/NB-IoT modem and GPS; Manufacturer: Nordic Semiconductor; Artikkelnr Noca: N.A.; Part Number: nRF9160-SICA; Manufacturer Part Number: nRF9160-SICA; Footprint Doc: LGA-161; Pin Count: 161; Value: nRF9160-SICA; HelpURL: *; LatestRevisionDate: 2019-02-14; Publisher: Nordic Semiconductor; Published: 2019-02-14; Note: *; Part number IPS: N.A.; Supplier 1: Mouser; Supplier 2: Digi-Key; Supplier Part Number 1: 949-NRF9160-SICA-R; Supplier Part Number 2: 1490-1076-1-ND
U2 = BGS12SN6: Wideband RF SPDT Switch; Manufacturer: Infineon Technologies; Manufacturer Part Number: BGS12SN6; Footprint Doc: TSNP-6-2; ComponentLink1Description: Datasheet; ComponentLink1URL: https://www.infineon.comhttps://www.infineon.com/dgdl/Infineon-BGS12SN6-DS-v01_02-en.pdf?fileId=db3a30433f1b26e8013f2db58bc03856; ComponentLink3Description: Digi-Key BGS12SN6; ComponentLink3URL: https://www.digikey.com/product-detail/en/infineon-technologies/BGS12SN6E6327XTSA1/BGS12SN6E6327XTSA1CT-ND/5764851; Value: BGS12SN6; Supplier 1: Digi-Key; Supplier Part Number 1: BGS12SN6E6327XTSA1CT-ND
U6 = SKY65943-11: GNSS Low-Noise Amplifier Front-End Module with Integrated Pre-Filter and Post-Filter; Manufacturer: Skyworks; Artikkelnr Noca: N.A.; Part Number: SKY65943-11; Manufacturer Part Number: SKY65943-11; Footprint Doc: MCM-10; Pin Count: 10; Value: SKY65943-11; ComponentLink1URL: http://www.skyworksinc.com/uploads/documents/SKY65943_11_204404F.pdf; ComponentLink1Description: Datasheet; ComponentLink2URL: https://www.digikey.com/product-detail/en/skyworks-solutions-inc/SKY65943-11/863-2032-1-ND; ComponentLink2Description: Supplier link; HelpURL: http://www.skyworksinc.com/Product/3579/SKY65943-11; LatestRevisionDate: 2019-04-16; Publisher: Nordic Semiconductor; Published: 2019-04-16; Note: *; Supplier 1: Digi-Key; Supplier Part Number 1: 863-2032-1-ND; Supplier 2: Mouser; Supplier Part Number 2: 873-SKY65943-11; Part number IPS: N.A.

## Sheet _sensors_and_IOs.SchDoc: Sensors and I/Os
size A3; CompanyName: Nordic Semiconductor ASA; DrawnBy: EISK; Address1: Otto Nielsens veg 12; Address2: 7052 Trondheim; Address3: NORWAY; Revision: 1; SheetNumber: 4; SheetTotal: 4; DesignStatus: Prototype; Version: 0.1.2
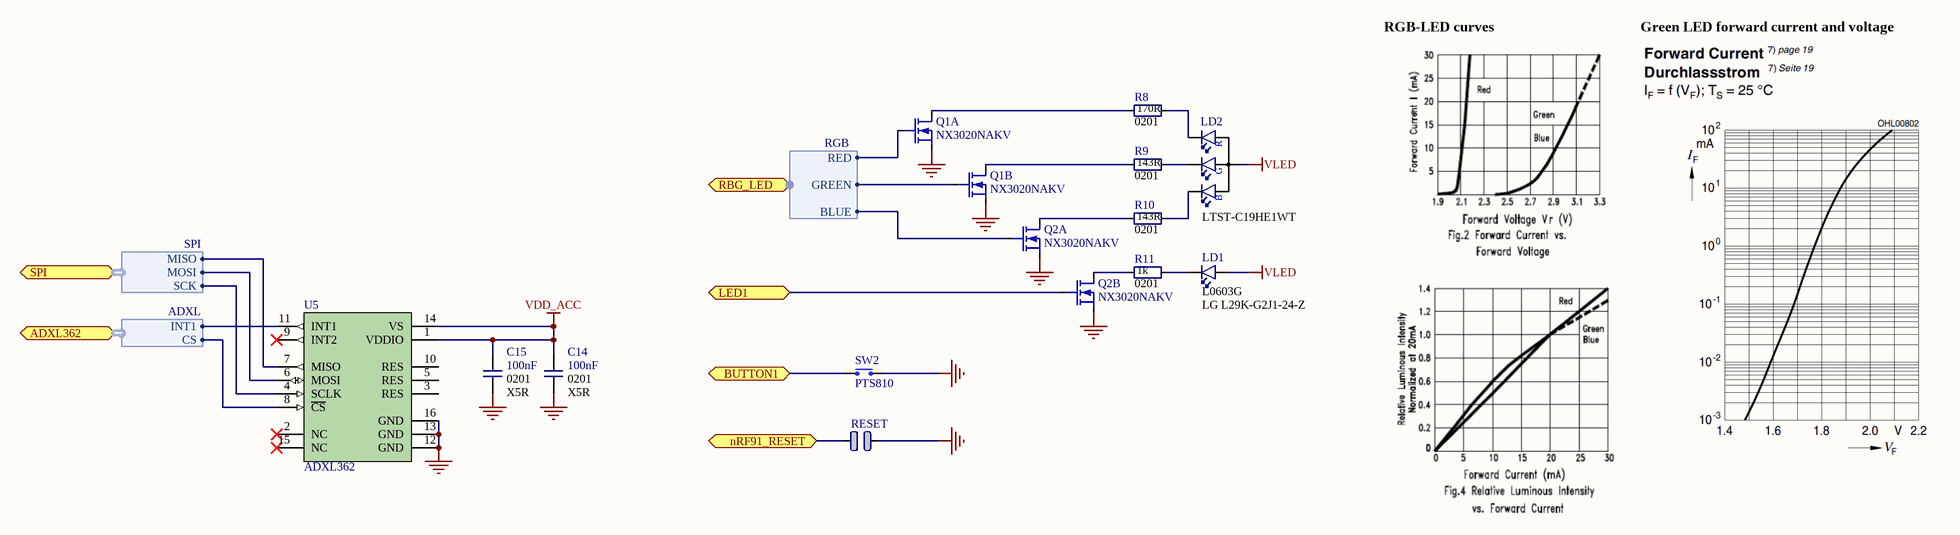
[diagram p3: _sensors_and_IOs.SchDoc]

### Parts
C14  100nF  Footprint Doc: 0201  TempCoeff: X5R  [CAPC0603X03L_C]
C15  100nF  Footprint Doc: 0201  TempCoeff: X5R  [CAPC0603X03L_C]
LD1  L0603G  Manufacturer Part Number: LG L29K-G2J1-24-Z  [LED_0603_G]
LD2  Part Number: LTST-C19HE1WT  [LED_RGB_0606]  (hidden comment: LED RGB)
Q1  NX3020NAKV  [NX3020NAKV]  (parts A,B of 2)
Q2  NX3020NAKV  [NX3020NAKV]  (parts A,B of 2)
R8  170R  Footprint Doc: 0201  [RESC0603X03L_C]
R9  143R  Footprint Doc: 0201  [RESC0603X03L_C]
R10  143R  Footprint Doc: 0201  [RESC0603X03L_C]
R11  1k  Footprint Doc: 0201  [RESC0603X03L_C]
RESET  Solderbridge  [Solderbridge]  (value not drawn)  (no BOM)
SW2  PTS810  [BTN_PTS810]
U5  ADXL362  [LGA50P322X300X114-16N]

### Ports
ADXL362 (bidir, harness ADXL), BUTTON1 (bidir), LED1 (bidir), nRF91_RESET (bidir), RBG_LED (bidir, harness RGB), SPI (bidir, harness SPI)

### Harnesses
SPI: MISO, MOSI, SCK
ADXL: CS, INT1
RGB: RED, GREEN, BLUE

### Nets
GND: C14.2 C15.2 Q1.1(S1) Q1.4(S2) Q2.1(S1) Q2.4(S2) RESET.1 SW2.1 U5.12(GND) U5.13(GND) U5.16(GND)
VDD_ACC: C14.1 C15.1 U5.1(VDDIO) U5.14(VS)
VLED: LD1.2(A) LD2.4(A)
nRF91_RESET: RESET.2 ; port nRF91_RESET
P0.00: SW2.2 ; port BUTTON1
P0.13/AIN0: Q1.2(G1) ; port RBG_LED.RED
P0.14/AIN1: Q1.5(G2) ; port RBG_LED.GREEN
P0.15/AIN2: Q2.2(G1) ; port RBG_LED.BLUE
P0.20/AIN7: Q2.5(G2) ; port LED1
P0.21: U5.11(INT1) ; port ADXL362.INT1
P0.22: U5.8(~{CS}) ; port ADXL362.CS
P0.23: U5.7(MISO) ; port SPI.MISO
P0.24: U5.6(MOSI) ; port SPI.MOSI
P0.25: U5.4(SCLK) ; port SPI.SCK
NetLD1_1: LD1.1(C) R11.2
NetLD2_1: LD2.1(C_RED) R8.2
NetLD2_2: LD2.2(C_GREEN) R9.2
NetLD2_3: LD2.3(C_BLUE) R10.2
NetQ1_3: Q1.3(D2) R9.1
NetQ1_6: Q1.6(D1) R8.1
NetQ2_3: Q2.3(D2) R11.1
NetQ2_6: Q2.6(D1) R10.1

Not connected (* = marked no-connect by the designer): U5 2(NC)* 3(RES) 5(RES) 9(INT2)* 10(RES) 15(NC)*

### Notes on the sheet
- RGB-LED curves
- Green LED forward current and voltage
- Title:
- Version:
- Drawn by:
- Status:
- Size:
- Sheet
- A3
- of
- Date:
- File:
- (in symbol D:LED_RGB) R; G; B

### Library data of the parts
C14 C15 = CAP:0201: as C9 on sheet _power; Manufacturer: *; Manufacturer Part Number: *; LatestRevisionDate: 2014-11-13; Pin Count: 2; Publisher: Nordic Semiconductor; Published: 2014-11-13; Value: 100nF; Note: 10V; HelpURL: *; Supplier 1: *; Supplier Part Number 1: *; Supplier 2: *; Supplier Part Number 2: *
LD1 = D:LED: LED, Green, 0603, 570nm, Vf=1.7V, 2.24..5.6mcd, - 40 to +100°C; Part Number: LG L29K Smartled Green; Manufacturer: Osram; Part number IPS: N.A.; Note: 2.24..5.6 mcd, Vfmin=1.7V; Artikkelnr Noca: 13019147; Footprint Doc: 0603; LatestRevisionDate: 2017-08-21; Pin Count: 2; Publisher: Nordic Semiconductor; Published: 2014-10-28; Value: L0603G; ComponentLink1URL: *; ComponentLink1Description: Datasheet; ComponentLink2URL: *; ComponentLink2Description: Supplier link; HelpURL: http://www.osram-os.com/Graphics/XPic2/00077107_0.pdf; Supplier 1: Digi-Key; Supplier Part Number 1: 475-2709-1-ND; Supplier 2: Mouser; Supplier Part Number 2: 720-LGL29KG2J124Z
LD2 = D:LED_RGB: RGB LED 1.60 mm x 1.60 mm SMD; Manufacturer: Lite-On Inc; 2nd source part number: 859-LTST-C19HE1WT; Part number IPS: 00000007798; Artikkelnr Noca: N.A.; Manufacturer Part Number: LTST-C19HE1WT; Datasheet: http://optoelectronics.liteon.com/upload/download/DS22-2008-0044/S_110_LTST-C19HE1WT.pdf; LatestRevisionDate: 2016-09-23; Pin Count: 4; Publisher: Nordic Semiconductor; Published: 2016-09-23; Value: LED RGB; Note: *; Supplier: Digi-Key; Supplier part number: 160-2162-1-ND; 2nd source Supplier: Mouser; Footprint Doc: LED_RGB_0606; Artikkelnr Simpro: N.A.
Q1 Q2 = T:FET-N-DUAL: MOSFET 2N-CH 30V 0.2A SOT666; Manufacturer: Nexperia; Manufacturer Part Number: NX3020NAKV,115; Artikkelnr Noca: N.A.; Part Number: NX3020NAKV; ComponentLink1URL: https://assets.nexperia.com/documents/data-sheet/NX3020NAKV.pdf; ComponentLink1Description: Datasheet; ComponentLink2URL: *; ComponentLink2Description: Supplier link; HelpURL: *; Footprint Doc: SOT666; LatestRevisionDate: 2018-12-13; Pin Count: 6; Publisher: Nordic Semiconductor; Published: 2018-12-13; Value: NX3020NAKV; Note: *; Supplier 1: Mouser; Supplier Part Number 1: 771-NX3020NAKV115; Supplier 2: Digi-Key; Supplier Part Number 2: 1727-1287-1-ND; Part number IPS: N.A.
R8-R11 = RES:0201: Manufacturer: *; Manufacturer Part Number: *; Package: 0201; Publisher: Nordic Semiconductor; LatestRevisionDate: 2019-06-11
  R8: Value: 170R
  R9 R10: Value: 143R
  R11: Value: 1k
RESET = SOLDERBRIDGE: Note: Not in BOM; ComponentLink1URL: *; ComponentLink1Description: Datasheet; ComponentLink2URL: *; ComponentLink2Description: Supplier link; Footprint Doc: Solderbridge; Pin Count: 2; Publisher: Nordic Semiconductor; Published: 2019-07-17; Value: Solderbridge
SW2 = BUTTON: SWITCH TACTILE SPST-NO 0.05A 16V; Manufacturer Part Number: PTS810 SJM 250 SMTR LFS; Manufacturer: C&K; Note: NO; Value: PTS810; Supplier 1: Digi-Key; Supplier Part Number 1: CKN10502CT-ND; ComponentLink1Description: Datasheet; ComponentLink1URL: https://www.ckswitches.com/media/1476/pts810.pdf; ComponentLink2Description: Digi-Key; ComponentLink2URL: https://www.digikey.no/product-detail/en/c-k/PTS810-SJM-250-SMTR-LFS/CKN10502DKR-ND/4176674; HelpDoc: https://www.ckswitches.com/media/1476/pts810.pdf
U5 = ADXL362: Micropower, 3-Axis, ±2 g/±4 g/±8 g Digital Output MEMS Accelerometer; Manufacturer: Analog Devices; Part number IPS: 00000001799; Artikkelnr Noca: N.A.; Part Number: ADXL362; Manufacturer Part Number: ADXL362; ComponentLink1URL: http://www.analog.com/media/en/technical-documentation/data-sheets/ADXL362.pdf; ComponentLink1Description: Datasheet; HelpURL: https://www.analog.com/media/en/technical-documentation/data-sheets/ADXL362.pdf; Footprint Doc: LGA-16; LatestRevisionDate: 2019-01-11; Pin Count: 16; Publisher: Nordic Semiconductor; Published: 2019-01-11; Value: ADXL362; Note: *; Supplier 1: Digi-Key; Supplier Part Number 1: ADXL362BCCZ-RL7CT-ND; Supplier 2: Mouser; Supplier Part Number 2: 584-ADXL362BCCZ-R7

## Nets that join several sheets
GND: _power (20 pins), _nRF9160 (66 pins), _sensors_and_IOs (11 pins)
VDD_ACC: _power (NT4.2), _sensors_and_IOs (C14.1 C15.1 U5.1 U5.14)
VDD_GPIO: _power (NT5.2 U4.1), _nRF9160 (C4.1 U1.12)
VDD_nRF91: _power (NT2.2), _nRF9160 (8 pins)
VDD_RF: _power (NT6.2), _nRF9160 (C2.1 U2.4 U6.3)
VLED: _power (NT3.2), _sensors_and_IOs (LD1.2 LD2.4)
nRF91_RESET: _nRF9160 (P1.3 P2.10 P3.10 U1.32), _sensors_and_IOs (RESET.2)
P0.00: _nRF9160 (U1.95), _sensors_and_IOs (SW2.2)
P0.01: _power (U4.15), _nRF9160 (TP1.1 U1.96)
P0.02: _power (U4.2), _nRF9160 (TP2.1 U1.97)
P0.03: _power (U4.16), _nRF9160 (TP3.1 U1.99)
P0.04: _power (U4.4), _nRF9160 (TP4.1 U1.100)
P0.13/AIN0: _nRF9160 (U1.23), _sensors_and_IOs (Q1.2)
P0.14/AIN1: _nRF9160 (U1.24), _sensors_and_IOs (Q1.5)
P0.15/AIN2: _nRF9160 (U1.25), _sensors_and_IOs (Q2.2)
P0.20/AIN7: _nRF9160 (U1.35), _sensors_and_IOs (Q2.5)
P0.21: _nRF9160 (U1.37), _sensors_and_IOs (U5.11)
P0.22: _nRF9160 (TP5.1 U1.38), _sensors_and_IOs (U5.8)
P0.23: _nRF9160 (TP8.1 U1.39), _sensors_and_IOs (U5.7)
P0.24: _nRF9160 (TP7.1 U1.40), _sensors_and_IOs (U5.6)
P0.25: _nRF9160 (TP6.1 U1.42), _sensors_and_IOs (U5.4)
P0.26: _power (U3.10), _nRF9160 (U1.83)
P0.27: _power (U3.19), _nRF9160 (U1.84)
P0.28: _power (U3.1), _nRF9160 (U1.86)
P0.29: _power (U3.2), _nRF9160 (U1.87)
P0.30: _power (U3.3), _nRF9160 (U1.88)
P0.31: _power (U3.4), _nRF9160 (U1.89)